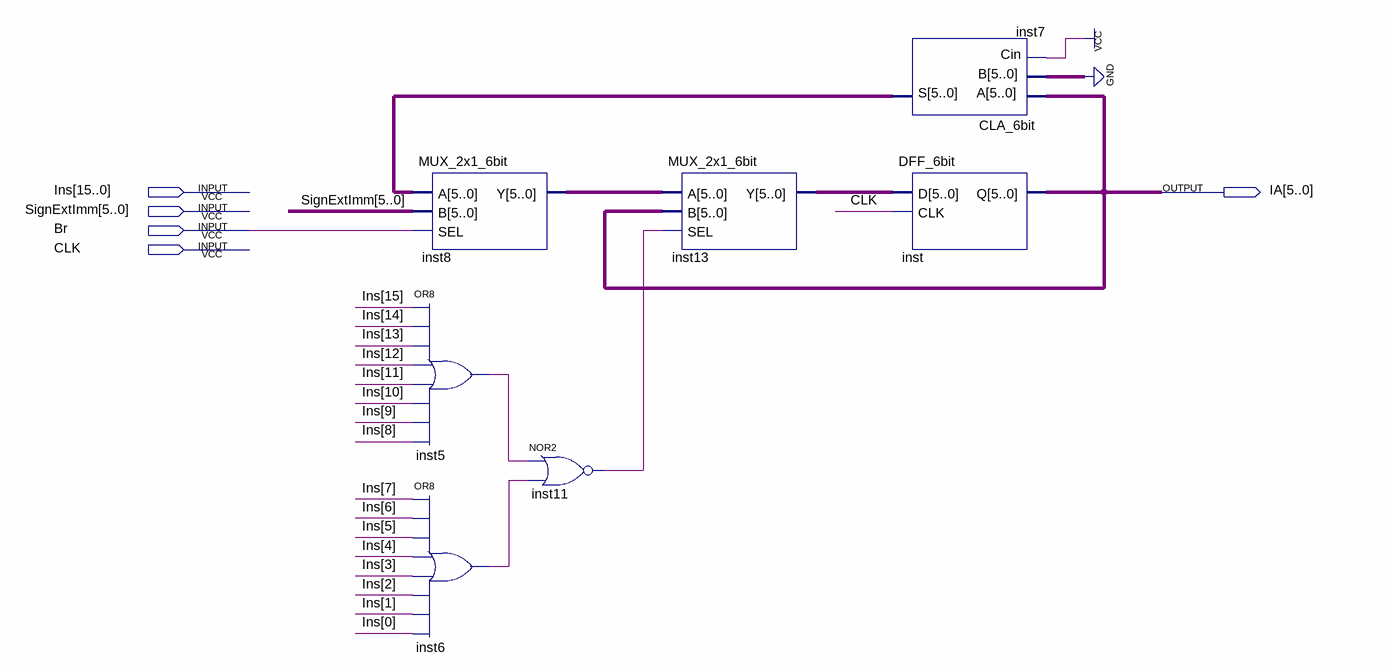
[diagram p0: schematic sheet]
// Quartus schematic PC.bdf as structural Verilog: 7 symbols, 5 pins
module PC (
  input  [15:0] Ins,
  input  [5:0] SignExtImm,
  input  Br,
  input  CLK,
  output [5:0] IA
);

  wire inst5_out, inst6_out, inst11_out;
  wire [5:0] inst7_s, inst8_y, inst13_y;

  MUX_2x1_6bit inst8 (.A(inst7_s), .B(SignExtImm), .SEL(Br), .Y(inst8_y));
  or inst5 (inst5_out, Ins[15], Ins[14], Ins[13], Ins[12], Ins[11], Ins[10], Ins[9], Ins[8]);
  or inst6 (inst6_out, Ins[7], Ins[6], Ins[5], Ins[4], Ins[3], Ins[2], Ins[1], Ins[0]);
  nor inst11 (inst11_out, inst5_out, inst6_out);
  MUX_2x1_6bit inst13 (.A(inst8_y), .B(IA), .SEL(inst11_out), .Y(inst13_y));
  CLA_6bit inst7 (.A(IA), .B({6{1'b0}}), .Cin(1'b1), .S(inst7_s));
  DFF_6bit inst (.D(inst13_y), .CLK(CLK), .Q(IA));
endmodule
